# Altium schematic sheet TopLevelProcessor400.SchDoc: ENEL 400 Top Level
size A4; Author: Ibrahim Khalid; CompanyName: Big Daddy AweScilloscope; Revision: 0.1; SheetNumber: 1; SheetTotal: 4
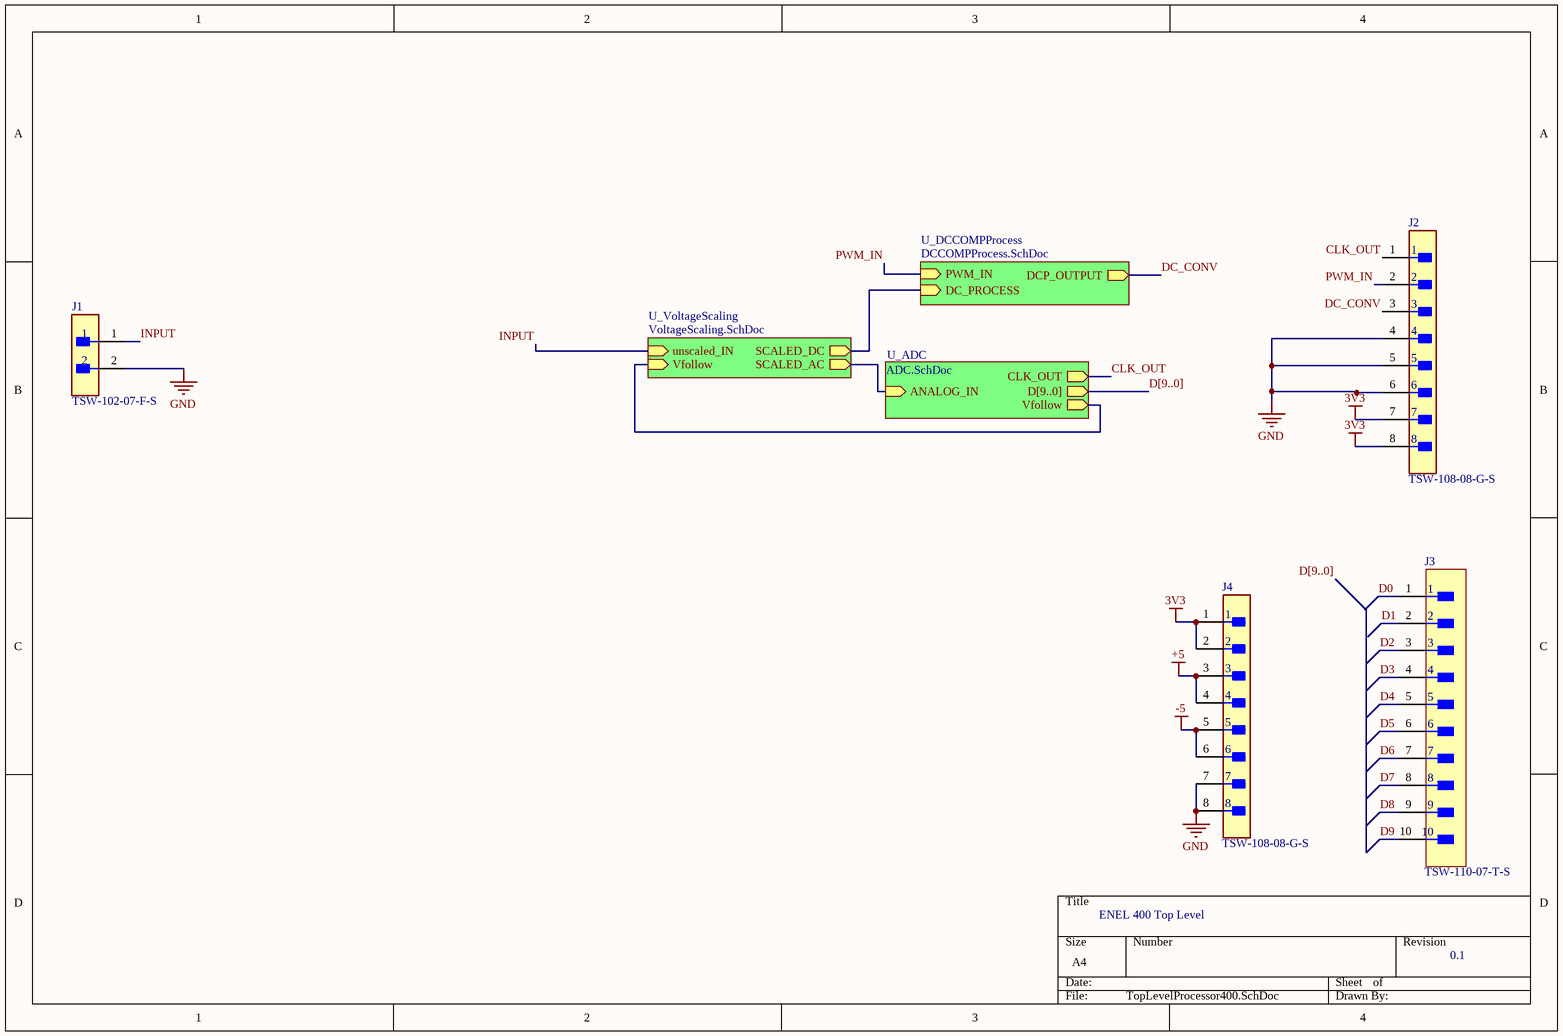
[diagram p0: TopLevelProcessor400.SchDoc]

## Parts
J1  TSW-102-07-F-S  [FP-TSW-102-07-F-S-MFG]
J2  TSW-108-08-G-S  [FP-TSW-108-08-G-S-MFG]
J3  TSW-110-07-T-S  [FP-TSW-110-07-T-S-MFG]
J4  TSW-108-08-G-S  [FP-TSW-108-08-G-S-MFG]

## Sub-sheets
U_ADC = ADC.SchDoc: D[9..0] (out), ANALOG_IN (in), Vfollow (out), CLK_OUT (out)
U_DCCOMPProcess = DCCOMPProcess.SchDoc: DC_PROCESS (in), DCP_OUTPUT (out), PWM_IN (in)
U_VoltageScaling = VoltageScaling.SchDoc: unscaled_IN (in), SCALED_AC (out), SCALED_DC (out), Vfollow (in)

## Nets
3V3: J2.7 J2.8 J4.1 J4.2
+5: J4.3 J4.4
-5: J4.5 J4.6
GND: J1.2 J2.4 J2.5 J2.6 J4.7 J4.8
CLK_OUT: J2.1 ; sheet U_ADC/CLK_OUT
D0: J3.1
D1: J3.2
D2: J3.3
D3: J3.4
D4: J3.5
D5: J3.6
D6: J3.7
D7: J3.8
D8: J3.9
D9: J3.10
DC_CONV: J2.3 ; sheet U_DCCOMPProcess/DCP_OUTPUT
INPUT: J1.1 ; sheet U_VoltageScaling/unscaled_IN
PWM_IN: J2.2 ; sheet U_DCCOMPProcess/PWM_IN
(unnamed): sheet U_VoltageScaling/SCALED_AC, sheet U_ADC/ANALOG_IN
(unnamed): sheet U_VoltageScaling/SCALED_DC, sheet U_DCCOMPProcess/DC_PROCESS
(unnamed): sheet U_VoltageScaling/Vfollow, sheet U_ADC/Vfollow

## Buses and harness runs
bus D[9..0]
bus D[9..0] = sheet U_ADC/D[9..0]

## Library data of the parts
J1 = CMP-02766-001458-1: CONN HEADER VERT 2POS 2.54MM; Gender: Male; Max Current Rating: 7.6A; Number of Contacts: 2; Max Voltage Rating (AC): 550V; Orientation: Straight; Depth: 2.54mm; Series: TSW; Package Quantity: 1; Min Operating Temperature: -55°C; Max Operating Temperature: 125°C; Contact Type: Male Pin; Contact Shape: Square; Color: Black; Housing Color: Black; Connector Type: Header; Fastening Type: Pull; Radiation Hardening: No; Pitch: 2.54mm; Housing Material: Polyester; Mount: Through Hole; Number of Positions: 2; Number of Rows: 1; Contact Material: Bronze; Insulation Color: Black; Contact Finish - Mating: GOLD; Termination: Solder; Insulation Material: PBT; Length: 5.08mm; Flammability Rating: UL94 V-0; Contact Mating Length: 0.23inch; REACH SVHC: No SVHC; Contact Plating: Gold; RoHS Compliant: Yes; Packaging: Bulk
J2 J4 = CMP-02766-000001-1: CONN HEADER VERT 8POS 2.54MM; Manufacturer: Samtec; Number Of Contacts: 8; Conn Orientation: Straight; Conn Gender: Male; Device Class L1: Connectors; ComponentLink2Description: Datasheet; Digikey Description: CONN HEADER VERT 8POS 2.54MM; ComponentLink2URL: http://suddendocs.samtec.com/catalog_english/tsw_th.pdf; Temperature: -55°C to +125°C; RoHS: TRUE; Mouser Description: TSW - Samtec 2.54mm Pin Header 13.46mm Overall Pin Length 5.08mm Tail; Automotive: No; Temperature Range High: +125°C; Package: TSW-108-08-G-S; Device Class L3: unset; Manufacturer Part Number: TSW-108-08-G-S; Pitch: 2.54mm; Number Of Rows: 1; Lead Free: Yes; Height: 8.71mm; Contact Material: Gold,Nickel; Footprint Url: http://suddendocs.samtec.com/prints/tsw-xxx-xx-x-x-xx-xxx-footprint.pdf; Temperature Range Low: -55°C; Octopart: https://octopart.com/tsw-108-08-g-s-samtec-272653; Category: Conn; Device Class L2: Headers and Wire Housings
J3 = CMP-00575-00272505-1: TSW-110-07-T-S TSW - Samtec 2.54mm Pin Header 10.92mm Overall Pin Length (07) (mcv)(TO22); Manufacturer Lifecycle Status: PRODUCTION; Connector Type: Male Pin; Number of Positions: 10; Max Current Rating: 7.6A; Gender: Male; Max Voltage Rating (AC): 550V; Max Operating Temperature: 105°C; Packaging: Bulk; Lead Free: Lead Free; Min Operating Temperature: -55°C; Width: 2.54mm; RoHS: Compliant; Depth: 2.54mm; Lifecycle Status: Production; REACH SVHC: No SVHC; Height: 8.71mm; Number of Rows: 1; Housing Material: Polyester; Orientation: Straight; Radiation Hardening: No; Number of Contacts: 10; Housing Color: Black; Mount: Through Hole; Lead Pitch: 2.54mm; Termination: Solder; Color: Black; Contact Material: Nickel, Tin; Number of Pins: 10; Length: 25.4mm; Pitch: 2.54mm; Contact Plating: Tin; Contact Mating Length: 5.842mm